# Altium schematic sheet PIR.SchDoc
size A
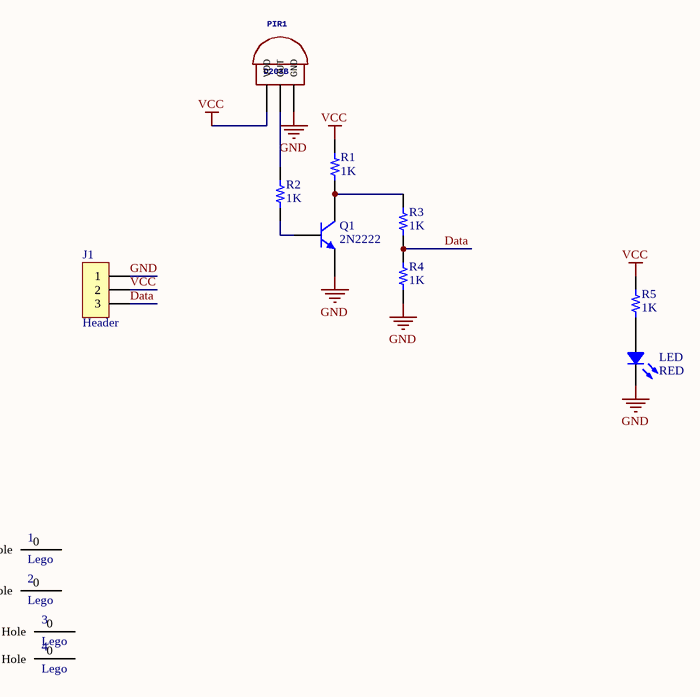
[diagram p0: PIR.SchDoc]

## Parts
1  Lego  [Lego Hole]
2  Lego  [Lego Hole]
3  Lego  [Lego Hole]
4  Lego  [Lego Hole]
J1  Header  [MOLEX SDA-70553-3PIN]
LED  RED  [LED 1206/3216 RED]
PIR1  D203B  [D203B]
Q1  2N2222  [SOT23]
R1  1K  [RES 1206/3216]
R2  1K  [RES 1206/3216]
R3  1K  [RES 1206/3216]
R4  1K  [RES 1206/3216]
R5  1K  [RES 1206/3216]

## Nets
GND: J1.1 LED.2 PIR1.3(GND) Q1.E R4.2
VCC: J1.2 PIR1.1(VDD) R1.1 R5.2
Data: J1.3 R3.2 R4.1
NetLED_1: LED.1 R5.1
NetPIR1_2: PIR1.2(OUT) R2.1
NetQ1_B: Q1.B R2.2
NetQ1_C: Q1.C R1.2 R3.1

Not connected (* = marked no-connect by the designer): 1 0(Lego_Hole); 2 0(Lego_Hole); 3 0(Lego_Hole); 4 0(Lego_Hole)

## Library data of the parts
J1 = 3 Pin
LED = LED: Chip LED; Value: Green
PIR1 = D203B: GateName_1: G$1; SymbolName_1: 3PIN; LibraryName: senba-pir-sensor; DeviceSetName: D203B; Package: 3PIN
Q1 = 2N2222: NPN; E-mail: picpars@gmail.com; De: Seyed Mohsen Ghasemian; web: www.picpars.com
R1-R5 = Resistor: SMT Resistor; Value: 1K